# EAGLE schematic GiGaMega_universal_2 (EAGLE 9.1.3)

## Sheet 1 of 2
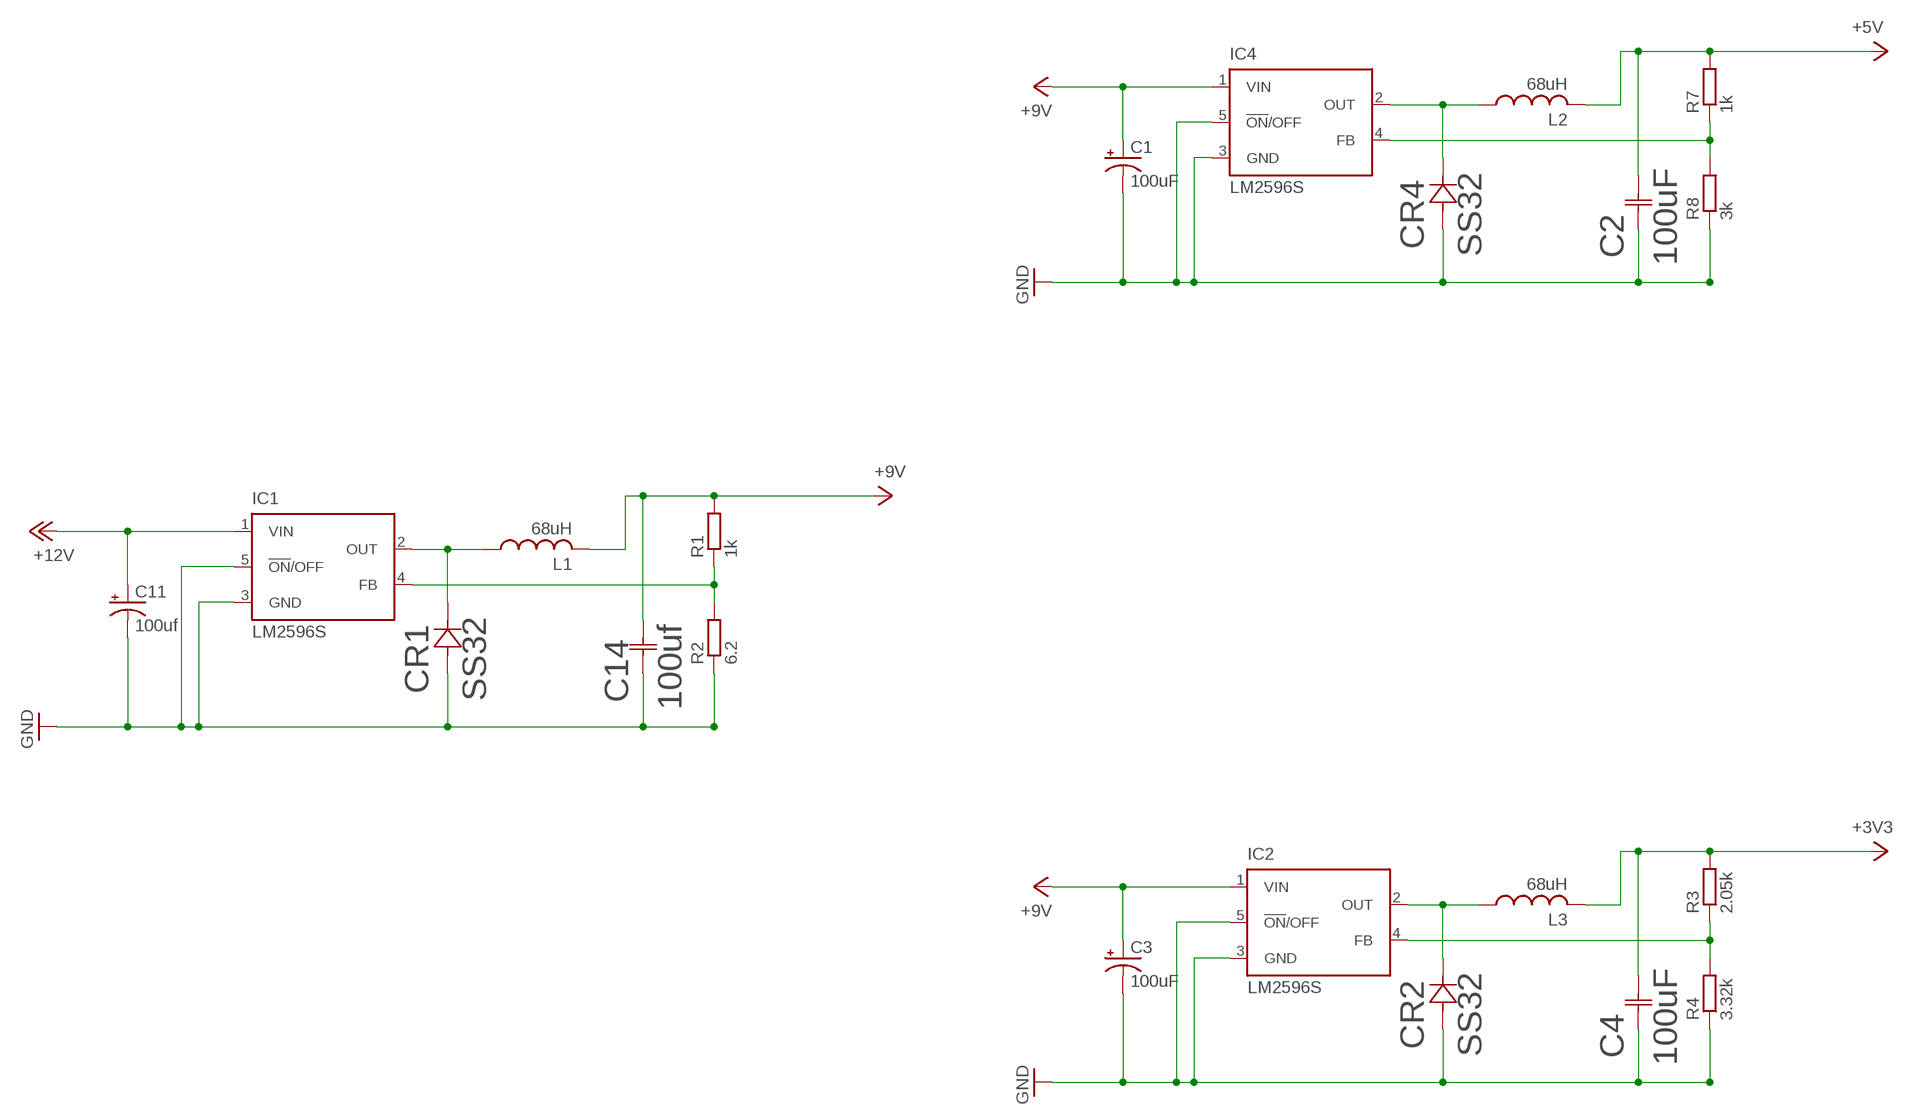
[diagram p0: schematic, sheet 1]

### Parts
C1  100uF  CPOL-USUD-6,3X7,7  [UD-6,3X7,7_NICHICON]
C2  100uF  TAJD107K020RNJTAJD-M  [TAJD-M]
C3  100uF  CPOL-USUD-6,3X7,7  [UD-6,3X7,7_NICHICON]
C4  100uF  TAJD107K020RNJTAJD-M  [TAJD-M]
C11  100uf  CPOL-USUD-6,3X7,7  [UD-6,3X7,7_NICHICON]
C14  100uf  TAJD107K020RNJTAJD-M  [TAJD-M]
CR1  SS32  SS32-E3/57TDIODE_DO214AB-M  [DIODE_DO214AB-M]
CR2  SS32  SS32-E3/57TDIODE_DO214AB-M  [DIODE_DO214AB-M]
CR4  SS32  SS32-E3/57TDIODE_DO214AB-M  [DIODE_DO214AB-M]
IC1  LM2596S  [TO263-5]
IC2  LM2596S  [TO263-5]
IC4  LM2596S  [TO263-5]
L1  68uH  L-USL3225P  [L3225P]
L2  68uH  L-USL3225P  [L3225P]
L3  68uH  L-USL3225P  [L3225P]
R1  1k  R-EU_R1206  [R1206]
R2  6.2  R-EU_R1206  [R1206]
R3  2.05k  R-EU_R1206  [R1206]
R4  3.32k  R-EU_R1206  [R1206]
R7  1k  R-EU_R1206  [R1206]
R8  3k  R-EU_R1206  [R1206]

### Nets
+3V3: C4.2 L3.2 R3.2 ; also sheet 2
+12V: C11.+ IC1.1(VIN)
D5: C2.2 L2.2 R7.2 ; supply symbol labelled +5V ; also sheet 2
GND: C1.- C2.1 C3.- C4.1 C11.- C14.1 CR1.2 CR2.2 CR4.2 IC1.3(GND) IC1.5(!ON!/OFF) IC2.3(GND) IC2.5(!ON!/OFF) IC4.3(GND) IC4.5(!ON!/OFF) R2.1 R4.1 R8.1 ; also sheet 2
N$1: IC2.4(FB) R3.1 R4.2
N$2: IC1.4(FB) R1.1 R2.2
N$3: CR1.1 IC1.2(OUT) L1.1
N$4: IC4.4(FB) R7.1 R8.2
N$5: CR4.1 IC4.2(OUT) L2.1
N$6: CR2.1 IC2.2(OUT) L3.1
VCC: C1.+ C3.+ C14.2 IC2.1(VIN) IC4.1(VIN) L1.2 R1.2 ; supply symbol labelled +9V ; also sheet 2

## Sheet 2 of 2
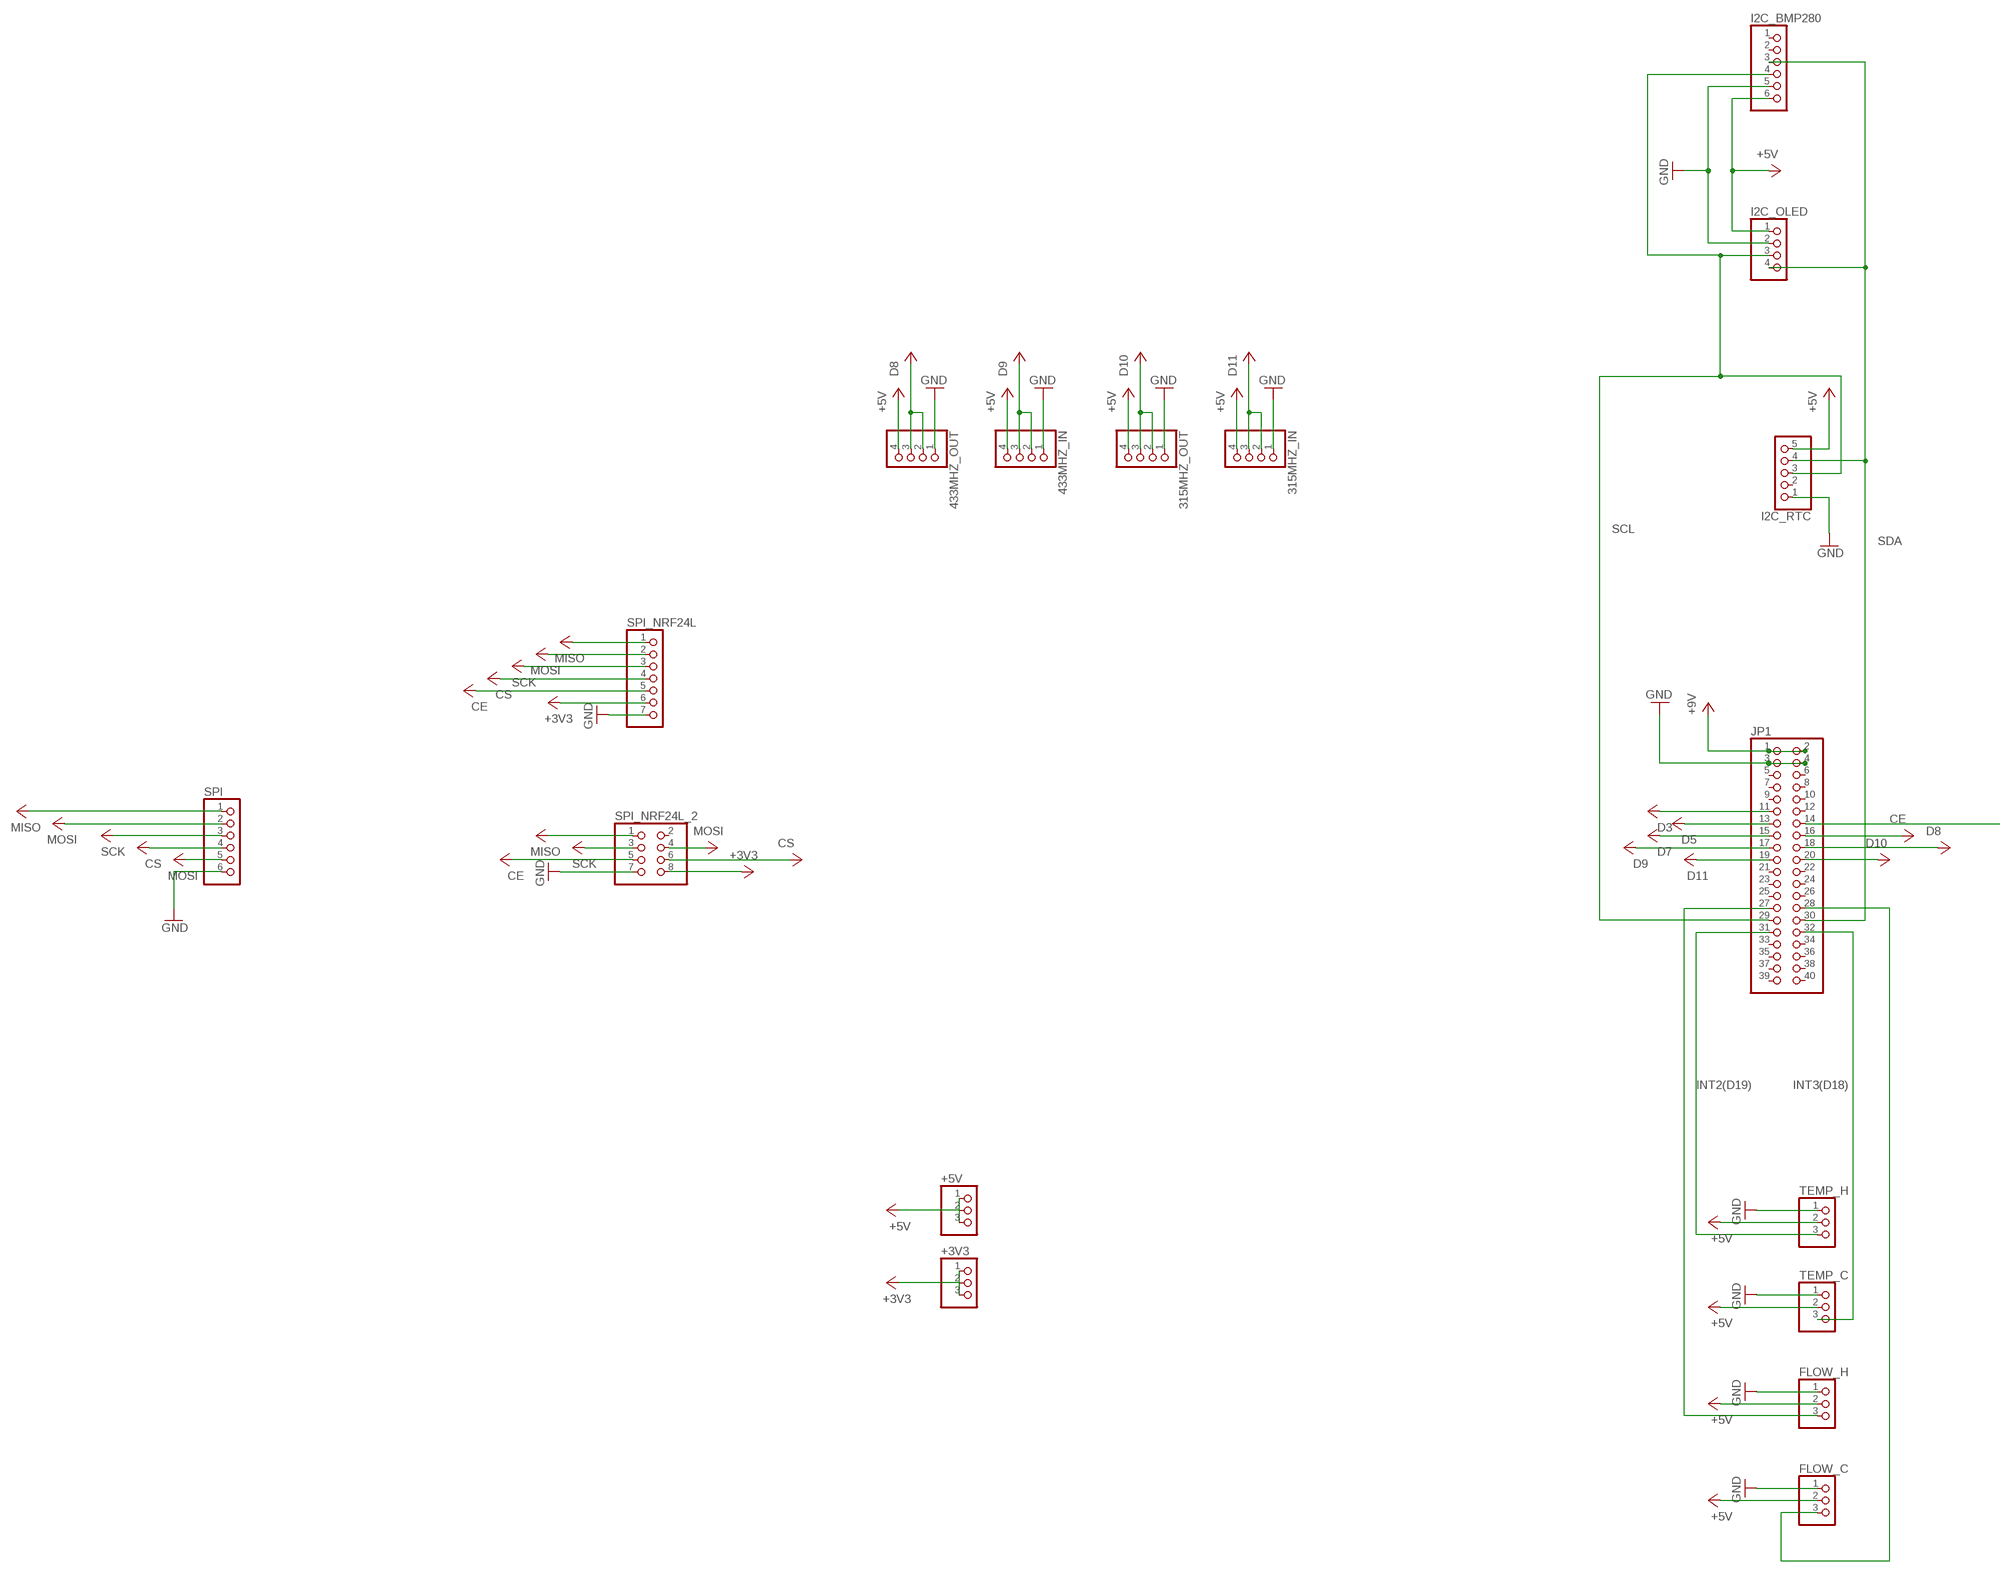
[diagram p1: schematic, sheet 2, part 1 of 2]
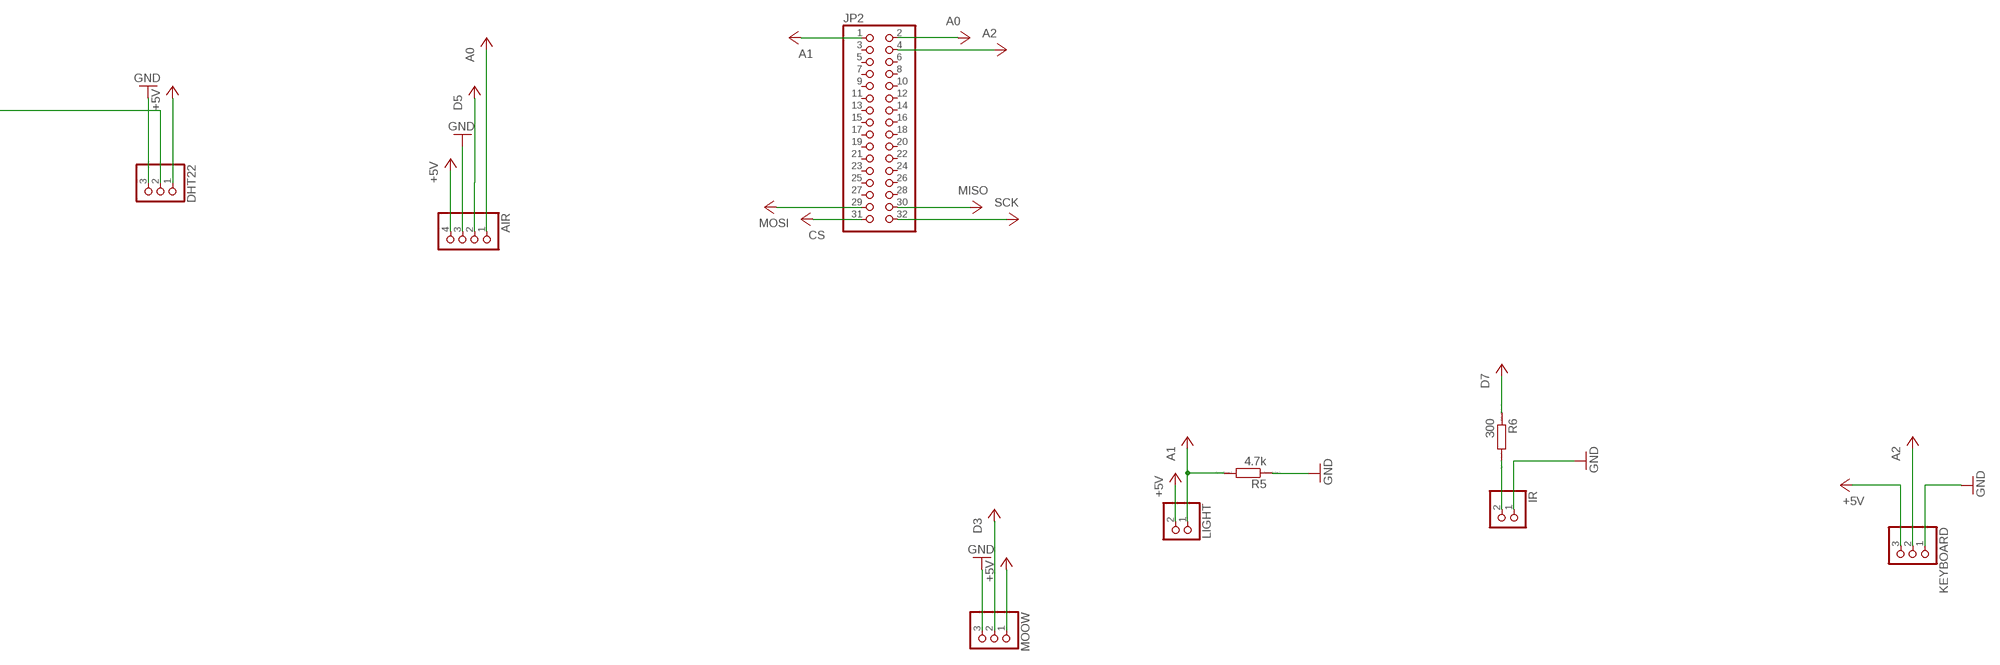
[diagram p2: schematic, sheet 2, part 2 of 2]

### Parts
315MHZ_IN  PINHD-1X4  [1X04]
315MHZ_OUT  PINHD-1X4  [1X04]
433MHZ_IN  PINHD-1X4  [1X04]
433MHZ_OUT  PINHD-1X4  [1X04]
+3V3  PINHD-1X3  [1X03]
+5V  PINHD-1X3  [1X03]
AIR  PINHD-1X4  [1X04]
DHT22  PINHD-1X3  [1X03]
FLOW_C  PINHD-1X3  [1X03]
FLOW_H  PINHD-1X3  [1X03]
I2C_BMP280  PINHD-1X6  [1X06]
I2C_OLED  PINHD-1X4  [1X04]
I2C_RTC  PINHD-1X5  [1X05]
IR  PINHD-1X2  [1X02]
JP1  PINHD-2X20  [2X20]
JP2  PINHD-2X16  [2X16]
KEYBOARD  PINHD-1X3  [1X03]
LIGHT  PINHD-1X2  [1X02]
MOOW  PINHD-1X3  [1X03]
R5  4.7k  RR1206  [R1206]
R6  300  RR1206  [R1206]
SPI  PINHD-1X6  [1X06]
SPI_NRF24L  PINHD-1X7  [1X07]
SPI_NRF24L_2  PINHD-2X4  [2X04]
TEMP_C  PINHD-1X3  [1X03]
TEMP_H  PINHD-1X3  [1X03]

### Nets
+3V3: +3V3.1 +3V3.2 +3V3.3 SPI_NRF24L.6 SPI_NRF24L_2.8 ; also sheet 1
+5V: 315MHZ_IN.2 315MHZ_IN.3 315MHZ_IN.4 315MHZ_OUT.2 315MHZ_OUT.3 315MHZ_OUT.4 433MHZ_IN.2 433MHZ_IN.3 433MHZ_IN.4 433MHZ_OUT.2 433MHZ_OUT.3 433MHZ_OUT.4 AIR.1 JP1.11 JP1.15 JP1.16 JP1.17 JP1.18 JP1.19 JP1.20 JP2.1 JP2.2 JP2.4 JP2.29 JP2.30 JP2.31 JP2.32 KEYBOARD.2 KEYBOARD.3 LIGHT.1 LIGHT.2 MOOW.1 MOOW.2 R5.2 R6.1 SPI.1 SPI.2 SPI.3 SPI.4 SPI.5 SPI_NRF24L.1 SPI_NRF24L.2 SPI_NRF24L.3 SPI_NRF24L.4 SPI_NRF24L.5 SPI_NRF24L_2.1 SPI_NRF24L_2.3 SPI_NRF24L_2.4 SPI_NRF24L_2.5 SPI_NRF24L_2.6 ; supply symbol labelled A0, D3, CE, SCK, MISO, CS, MOSI, A1, A2, D8, D9, D10, D11, D7
D5: +5V.1 +5V.2 +5V.3 AIR.2 AIR.4 DHT22.1 FLOW_C.2 FLOW_H.2 I2C_BMP280.6 I2C_OLED.1 I2C_RTC.5 JP1.13 TEMP_C.2 TEMP_H.2 ; supply symbol labelled +5V ; also sheet 1
GND: 315MHZ_IN.1 315MHZ_OUT.1 433MHZ_IN.1 433MHZ_OUT.1 AIR.3 DHT22.3 FLOW_C.1 FLOW_H.1 I2C_BMP280.5 I2C_OLED.2 I2C_RTC.1 IR.1 JP1.3 JP1.4 KEYBOARD.1 MOOW.3 R5.1 SPI.6 SPI_NRF24L.7 SPI_NRF24L_2.7 TEMP_C.1 TEMP_H.1 ; also sheet 1
INT2(D19): FLOW_H.3 JP1.27
INT3(D18): FLOW_C.3 JP1.28
N$7: JP1.31 TEMP_H.3
N$8: JP1.32 TEMP_C.3
N$9: DHT22.2 JP1.14
N$11: IR.2 R6.2
SCL: I2C_BMP280.4 I2C_OLED.3 I2C_RTC.3 JP1.29
SDA: I2C_BMP280.3 I2C_OLED.4 I2C_RTC.4 JP1.30
VCC: JP1.1 JP1.2 ; supply symbol labelled +9V ; also sheet 1
Unconnected: I2C_BMP280.1 I2C_BMP280.2 I2C_RTC.2 JP1.5 JP1.6 JP1.7 JP1.8 JP1.9 JP1.10 JP1.12 JP1.21 JP1.22 JP1.23 JP1.24 JP1.25 JP1.26 JP1.33 JP1.34 JP1.35 JP1.36 JP1.37 JP1.38 JP1.39 JP1.40 JP2.3 JP2.5 JP2.6 JP2.7 JP2.8 JP2.9 JP2.10 JP2.11 JP2.12 JP2.13 JP2.14 JP2.15 JP2.16 JP2.17 JP2.18 JP2.19 JP2.20 JP2.21 JP2.22 JP2.23 JP2.24 JP2.25 JP2.26 JP2.27 JP2.28 SPI_NRF24L_2.2

## Library data of the parts
315MHZ_IN 315MHZ_OUT 433MHZ_IN 433MHZ_OUT AIR I2C_OLED = pinhead:PINHD-1X4: PIN HEADER
+3V3 +5V DHT22 FLOW_C FLOW_H KEYBOARD MOOW TEMP_C TEMP_H = pinhead:PINHD-1X3: PIN HEADER
C1 C3 C11 = rcl:CPOL-US: POLARIZED CAPACITOR, American symbol; SPICEPREFIX: C
C2 C4 C14 = capacitor_tantal:TAJD107K020RNJ; MANUFACTURER_PART_NUMBER: TAJD107K020RNJ; VENDOR: AVX Corporation
CR1 CR2 CR4 = SS32:SS32-E3/57T; MANUFACTURER_PART_NUMBER: SS32E357T; VENDOR: Vishay
I2C_BMP280 SPI = pinhead:PINHD-1X6: PIN HEADER
I2C_RTC = pinhead:PINHD-1X5: PIN HEADER
IC1 IC2 IC4 = national-semiconductor:LM2596: SIMPLE SWITCHER® Power Converter 150 kHz 3A Step-Down Voltage Regulator Source: http://www.national.com/ds/LM/LM2596.pdf; MF: NATIONAL SEMICONDUCTOR; MPN: LM2596S-ADJ/NOPB; OC_FARNELL: 9494367; OC_NEWARK: 41K3842
IR LIGHT = pinhead:PINHD-1X2: PIN HEADER
JP1 = pinhead:PINHD-2X20: PIN HEADER
JP2 = pinhead:PINHD-2X16: PIN HEADER
L1-L3 = rcl:L-US: INDUCTOR, American symbol; SPICEPREFIX: L
R1-R4 R7 R8 = rcl:R-EU_: RESISTOR, European symbol; SPICEPREFIX: R
R5 R6 = eagle-ltspice:R: RESISTOR, European symbol; SPICEMODEL: NONE; SPICEPREFIX: R
SPI_NRF24L = pinhead:PINHD-1X7: PIN HEADER
SPI_NRF24L_2 = pinhead:PINHD-2X4: PIN HEADER